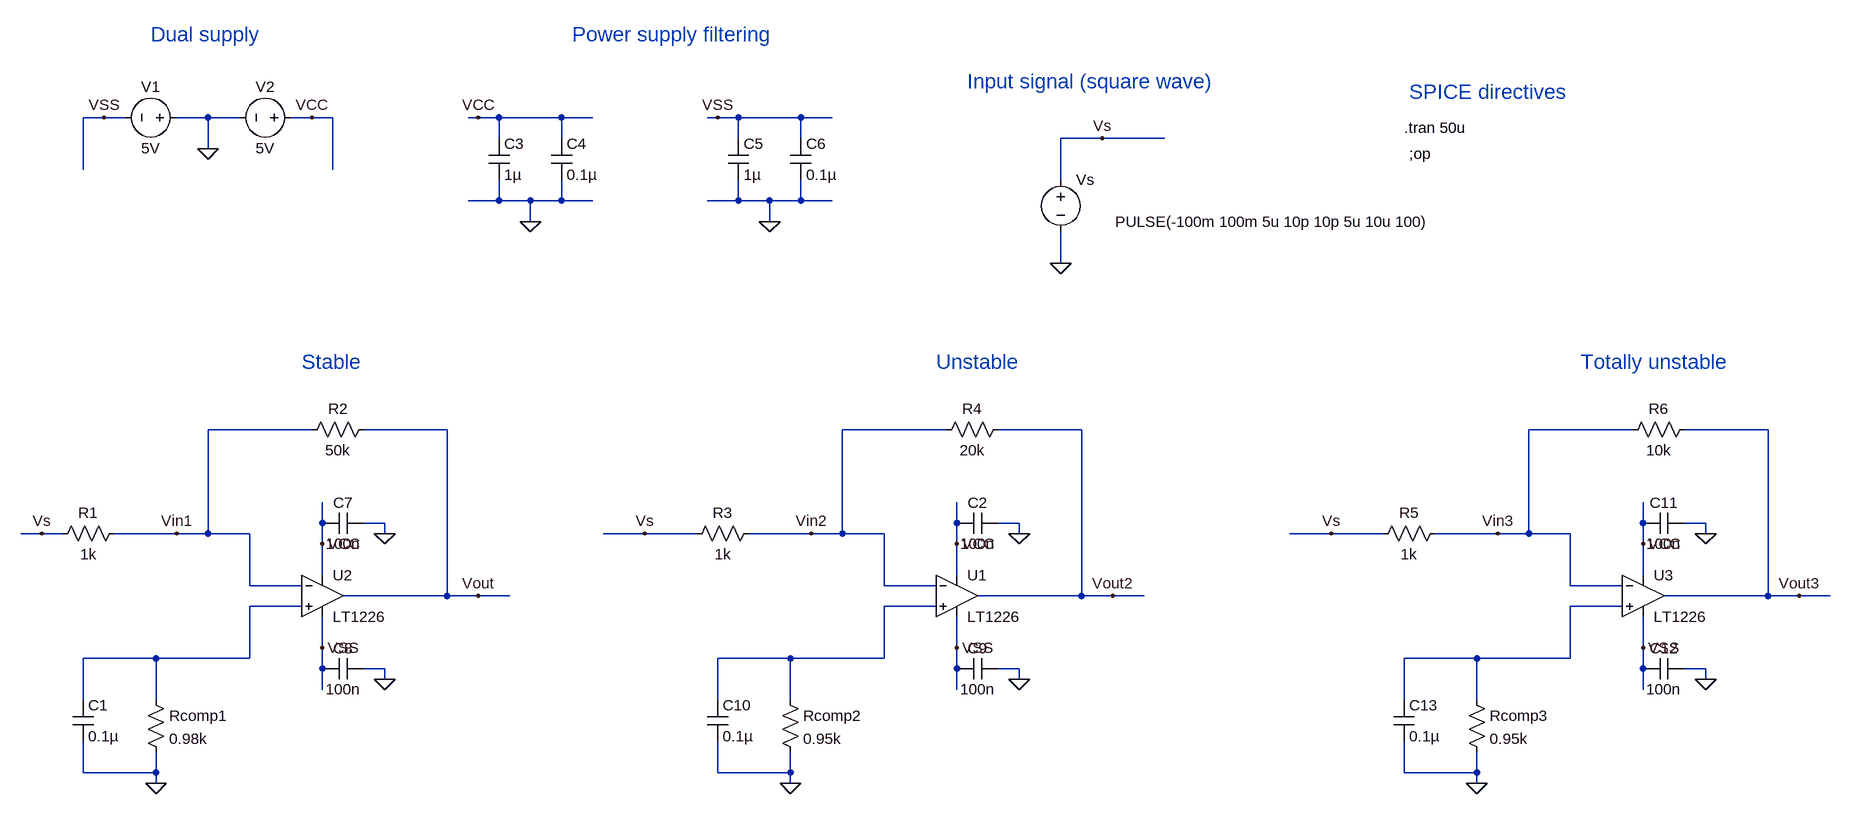
[diagram p0: schematic tb_stability.asc]
tb_stability.asc, the LTspice schematic file:
Version 4
SHEET 1 2184 868
WIRE -848 -288 -880 -288
WIRE -816 -288 -848 -288
WIRE -688 -288 -736 -288
WIRE -640 -288 -688 -288
WIRE -528 -288 -560 -288
WIRE -496 -288 -528 -288
WIRE -272 -288 -288 -288
WIRE -240 -288 -272 -288
WIRE -144 -288 -240 -288
WIRE -96 -288 -144 -288
WIRE 96 -288 80 -288
WIRE 128 -288 96 -288
WIRE 224 -288 128 -288
WIRE 272 -288 224 -288
WIRE -240 -256 -240 -288
WIRE -144 -256 -144 -288
WIRE 128 -256 128 -288
WIRE 224 -256 224 -288
WIRE 688 -256 624 -256
WIRE 784 -256 688 -256
WIRE -688 -240 -688 -288
WIRE -880 -208 -880 -288
WIRE -496 -208 -496 -288
WIRE 624 -192 624 -256
WIRE -240 -160 -240 -192
WIRE -240 -160 -288 -160
WIRE -192 -160 -240 -160
WIRE -144 -160 -144 -192
WIRE -144 -160 -192 -160
WIRE -96 -160 -144 -160
WIRE 128 -160 128 -192
WIRE 128 -160 80 -160
WIRE 176 -160 128 -160
WIRE 224 -160 224 -192
WIRE 224 -160 176 -160
WIRE 272 -160 224 -160
WIRE -192 -128 -192 -160
WIRE 176 -128 176 -160
WIRE 624 -64 624 -112
WIRE -528 192 -688 192
WIRE -320 192 -448 192
WIRE 448 192 288 192
WIRE 656 192 528 192
WIRE 1504 192 1344 192
WIRE 1712 192 1584 192
WIRE -512 336 -512 304
WIRE -416 336 -448 336
WIRE 464 336 464 304
WIRE 560 336 528 336
WIRE 1520 336 1520 304
WIRE 1616 336 1584 336
WIRE -944 352 -976 352
WIRE -912 352 -944 352
WIRE -736 352 -832 352
WIRE -688 352 -688 192
WIRE -688 352 -736 352
WIRE -624 352 -688 352
WIRE -416 352 -416 336
WIRE -16 352 -80 352
WIRE 64 352 -16 352
WIRE 240 352 144 352
WIRE 288 352 288 192
WIRE 288 352 240 352
WIRE 352 352 288 352
WIRE 560 352 560 336
WIRE 1040 352 976 352
WIRE 1120 352 1040 352
WIRE 1296 352 1200 352
WIRE 1344 352 1344 192
WIRE 1344 352 1296 352
WIRE 1408 352 1344 352
WIRE 1616 352 1616 336
WIRE -512 368 -512 336
WIRE 464 368 464 336
WIRE 1520 368 1520 336
WIRE -512 416 -512 368
WIRE 464 416 464 368
WIRE 1520 416 1520 368
WIRE -624 432 -624 352
WIRE -544 432 -624 432
WIRE 352 432 352 352
WIRE 432 432 352 432
WIRE 1408 432 1408 352
WIRE 1488 432 1408 432
WIRE -320 448 -320 192
WIRE -320 448 -480 448
WIRE -272 448 -320 448
WIRE -224 448 -272 448
WIRE 656 448 656 192
WIRE 656 448 496 448
WIRE 704 448 656 448
WIRE 752 448 704 448
WIRE 1712 448 1712 192
WIRE 1712 448 1552 448
WIRE 1760 448 1712 448
WIRE 1808 448 1760 448
WIRE -544 464 -624 464
WIRE 432 464 352 464
WIRE 1488 464 1408 464
WIRE -512 528 -512 480
WIRE 464 528 464 480
WIRE 1520 528 1520 480
WIRE -768 544 -880 544
WIRE -624 544 -624 464
WIRE -624 544 -768 544
WIRE 208 544 96 544
WIRE 352 544 352 464
WIRE 352 544 208 544
WIRE 1264 544 1152 544
WIRE 1408 544 1408 464
WIRE 1408 544 1264 544
WIRE -512 560 -512 528
WIRE -416 560 -448 560
WIRE 464 560 464 528
WIRE 560 560 528 560
WIRE 1520 560 1520 528
WIRE 1616 560 1584 560
WIRE -416 576 -416 560
WIRE 560 576 560 560
WIRE 1616 576 1616 560
WIRE -512 592 -512 560
WIRE 464 592 464 560
WIRE 1520 592 1520 560
WIRE -880 608 -880 544
WIRE -768 608 -768 544
WIRE 96 608 96 544
WIRE 208 608 208 544
WIRE 1152 608 1152 544
WIRE 1264 608 1264 544
WIRE -880 720 -880 672
WIRE -768 720 -768 688
WIRE -768 720 -880 720
WIRE 96 720 96 672
WIRE 208 720 208 688
WIRE 208 720 96 720
WIRE 1152 720 1152 672
WIRE 1264 720 1264 688
WIRE 1264 720 1152 720
WIRE -768 736 -768 720
WIRE 208 736 208 720
WIRE 1264 736 1264 720
FLAG -688 -240 0
FLAG -528 -288 VCC
FLAG -848 -288 VSS
FLAG -192 -128 0
FLAG 176 -128 0
FLAG -272 -288 VCC
FLAG 96 -288 VSS
FLAG -512 368 VCC
FLAG -512 528 VSS
FLAG -416 352 0
FLAG -416 576 0
FLAG -272 448 Vout
FLAG -768 736 0
FLAG 624 -64 0
FLAG -736 352 Vin1
FLAG 464 368 VCC
FLAG 464 528 VSS
FLAG 560 352 0
FLAG 560 576 0
FLAG 704 448 Vout2
FLAG 208 736 0
FLAG 240 352 Vin2
FLAG 688 -256 Vs
FLAG -16 352 Vs
FLAG 1520 368 VCC
FLAG 1520 528 VSS
FLAG 1616 352 0
FLAG 1616 576 0
FLAG 1760 448 Vout3
FLAG 1264 736 0
FLAG 1296 352 Vin3
FLAG 1040 352 Vs
FLAG -944 352 Vs
SYMBOL voltage -720 -288 R90
WINDOW 0 -32 56 VBottom 2
WINDOW 3 32 56 VTop 2
WINDOW 123 0 0 Left 2
WINDOW 39 0 0 Left 2
SYMATTR InstName V1
SYMATTR Value 5V
SYMBOL voltage -544 -288 R90
WINDOW 0 -32 56 VBottom 2
WINDOW 3 32 56 VTop 2
SYMATTR InstName V2
SYMATTR Value 5V
SYMBOL cap -256 -256 R0
SYMATTR InstName C3
SYMATTR Value 1µ
SYMBOL cap -160 -256 R0
SYMATTR InstName C4
SYMATTR Value 0.1µ
SYMBOL cap 112 -256 R0
SYMATTR InstName C5
SYMATTR Value 1µ
SYMBOL cap 208 -256 R0
SYMATTR InstName C6
SYMATTR Value 0.1µ
SYMBOL Opamps\\LT1226 -512 384 R0
SYMATTR InstName U2
SYMBOL cap -448 320 R90
WINDOW 0 0 32 VBottom 2
WINDOW 3 32 32 VTop 2
SYMATTR InstName C7
SYMATTR Value 100n
SYMBOL cap -448 544 R90
WINDOW 0 0 32 VBottom 2
WINDOW 3 32 32 VTop 2
SYMATTR InstName C8
SYMATTR Value 100n
SYMBOL res -784 592 R0
SYMATTR InstName Rcomp1
SYMATTR Value 0.98k
SYMBOL cap -896 608 R0
SYMATTR InstName C1
SYMATTR Value 0.1µ
SYMBOL voltage 624 -208 R0
WINDOW 3 84 80 Left 2
WINDOW 123 0 0 Left 2
WINDOW 39 0 0 Left 2
SYMATTR Value PULSE(-100m 100m 5u 10p 10p 5u 10u 100)
SYMATTR InstName Vs
SYMBOL res -816 336 R90
WINDOW 0 0 56 VBottom 2
WINDOW 3 32 56 VTop 2
SYMATTR InstName R1
SYMATTR Value 1k
SYMBOL res -432 176 R90
WINDOW 0 0 56 VBottom 2
WINDOW 3 32 56 VTop 2
SYMATTR InstName R2
SYMATTR Value 50k
SYMBOL Opamps\\LT1226 464 384 R0
SYMATTR InstName U1
SYMBOL cap 528 320 R90
WINDOW 0 0 32 VBottom 2
WINDOW 3 32 32 VTop 2
SYMATTR InstName C2
SYMATTR Value 100n
SYMBOL cap 528 544 R90
WINDOW 0 0 32 VBottom 2
WINDOW 3 32 32 VTop 2
SYMATTR InstName C9
SYMATTR Value 100n
SYMBOL res 192 592 R0
SYMATTR InstName Rcomp2
SYMATTR Value 0.95k
SYMBOL cap 80 608 R0
SYMATTR InstName C10
SYMATTR Value 0.1µ
SYMBOL res 160 336 R90
WINDOW 0 0 56 VBottom 2
WINDOW 3 32 56 VTop 2
SYMATTR InstName R3
SYMATTR Value 1k
SYMBOL res 544 176 R90
WINDOW 0 0 56 VBottom 2
WINDOW 3 32 56 VTop 2
SYMATTR InstName R4
SYMATTR Value 20k
SYMBOL Opamps\\LT1226 1520 384 R0
SYMATTR InstName U3
SYMBOL cap 1584 320 R90
WINDOW 0 0 32 VBottom 2
WINDOW 3 32 32 VTop 2
SYMATTR InstName C11
SYMATTR Value 100n
SYMBOL cap 1584 544 R90
WINDOW 0 0 32 VBottom 2
WINDOW 3 32 32 VTop 2
SYMATTR InstName C12
SYMATTR Value 100n
SYMBOL res 1248 592 R0
SYMATTR InstName Rcomp3
SYMATTR Value 0.95k
SYMBOL cap 1136 608 R0
SYMATTR InstName C13
SYMATTR Value 0.1µ
SYMBOL res 1216 336 R90
WINDOW 0 0 56 VBottom 2
WINDOW 3 32 56 VTop 2
SYMATTR InstName R5
SYMATTR Value 1k
SYMBOL res 1600 176 R90
WINDOW 0 0 56 VBottom 2
WINDOW 3 32 56 VTop 2
SYMATTR InstName R6
SYMATTR Value 10k
TEXT -776 -416 Left 3 ;Dual supply
TEXT -128 -416 Left 3 ;Power supply filtering
TEXT 1152 -272 Left 2 !.tran 50u
TEXT -544 88 Left 3 ;Stable
TEXT 1160 -328 Left 3 ;SPICE directives
TEXT 1160 -232 Left 2 !;op
TEXT 432 88 Left 3 ;Unstable
TEXT 480 -344 Left 3 ;Input signal (square wave)
TEXT 1424 88 Left 3 ;Totally unstable

The netlist it stands for:
* tb_stability.asc
V1 0 VSS 5V
V2 VCC 0 5V
C3 VCC 0 1µ
C4 VCC 0 0.1µ
C5 VSS 0 1µ
C6 VSS 0 0.1µ
XU2 N001 Vin1 VCC VSS Vout LT1226  ; pins In+ In- V+ V- OUT
C7 0 VCC 100n
C8 0 VSS 100n
Rcomp1 N001 0 0.98k
C1 N001 0 0.1µ
Vs Vs 0 PULSE(-100m 100m 5u 10p 10p 5u 10u 100)
R1 Vin1 Vs 1k
R2 Vout Vin1 50k
XU1 N002 Vin2 VCC VSS Vout2 LT1226  ; pins In+ In- V+ V- OUT
C2 0 VCC 100n
C9 0 VSS 100n
Rcomp2 N002 0 0.95k
C10 N002 0 0.1µ
R3 Vin2 Vs 1k
R4 Vout2 Vin2 20k
XU3 N003 Vin3 VCC VSS Vout3 LT1226  ; pins In+ In- V+ V- OUT
C11 0 VCC 100n
C12 0 VSS 100n
Rcomp3 N003 0 0.95k
C13 N003 0 0.1µ
R5 Vin3 Vs 1k
R6 Vout3 Vin3 10k
* Dual supply
* Power supply filtering
.tran 50u
* Stable
* SPICE directives
;op
* Unstable
* Input signal (square wave)
* Totally unstable
.backanno
.end